# Altium schematic sheet 5_SDRAM.SchDoc: LX9-EVAL Board
size OrCAD A; DocumentNumber: 5; SheetNumber: 6; SheetTotal: 8; PageSetup: Record=PageOptions|CenterHorizontal=True|CenterVertical=True|PrintScale=1.03|XCorrection=1.00|YCorrection=1.00|PrintKind=0|BorderSize=5000000|LeftOffset=0|BottomOffset=0|Orientation=2|PaperLength=1000|PaperWidth=1000|Scale=100|PaperSource=7|PrintQuality=-4|MediaType=1|DitherType=10|PrintScaleMode=1|PaperKind=A4|PaperIndex=9
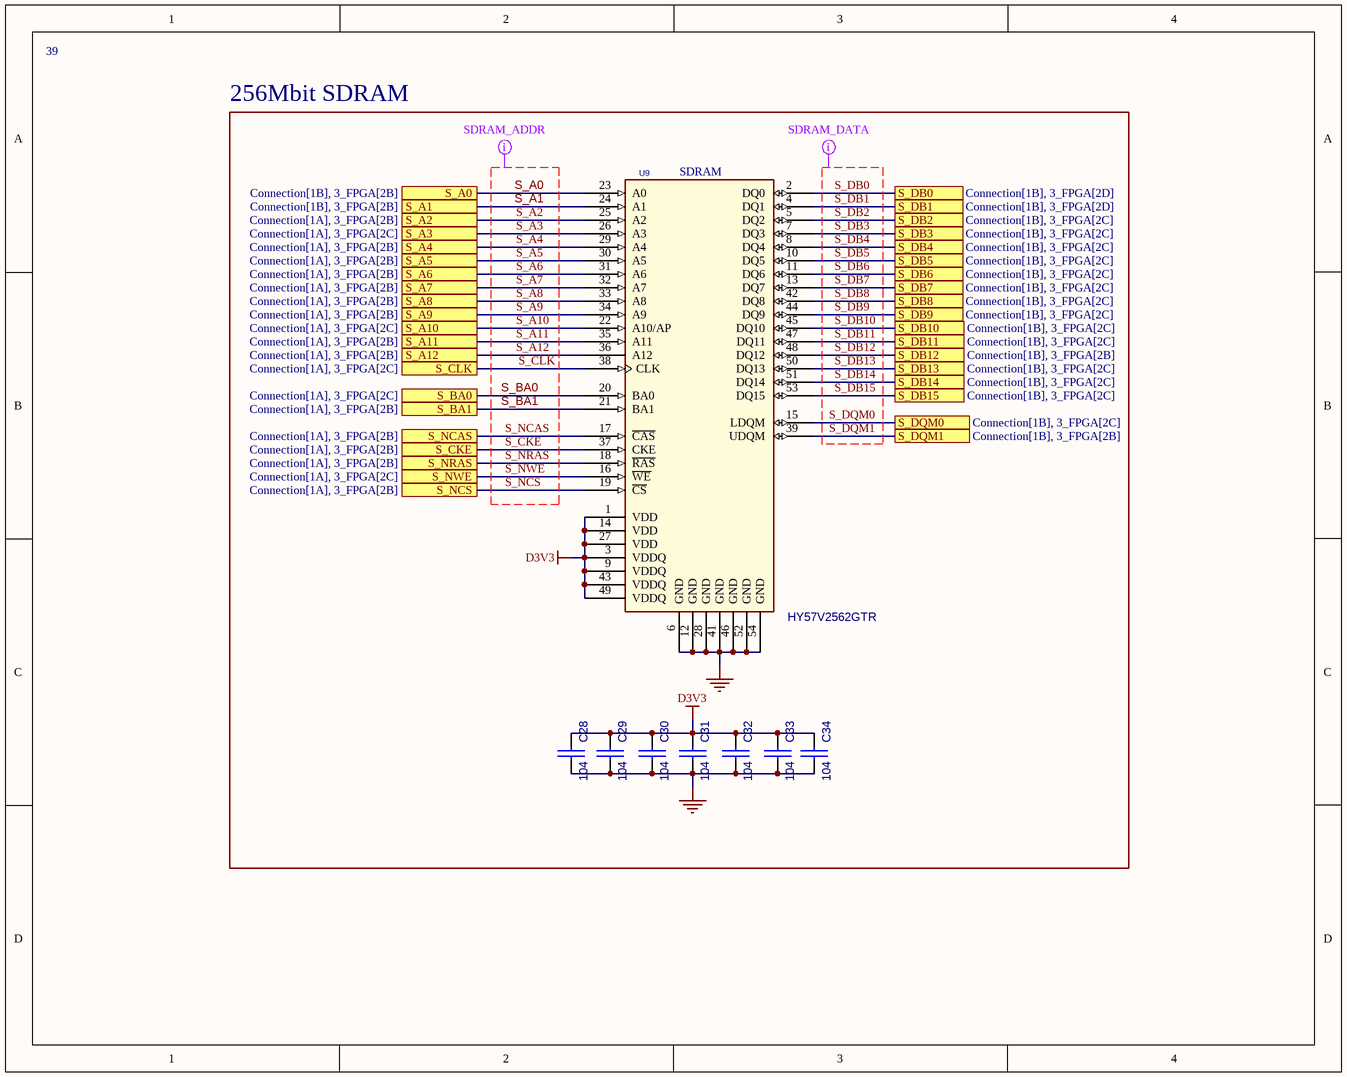
[diagram p0: 5_SDRAM.SchDoc]

## Parts
C28  104  [0402 Cap]
C29  104  [0402 Cap]
C30  104  [0402 Cap]
C31  104  [0402 Cap]
C32  104  [0402 Cap]
C33  104  [0402 Cap]
C34  104  [0402 Cap]
U9  HY57V2562GTR  [TSOP-54]

## Ports
S_A0 (see Connection[1B], 3_FPGA[2B]), S_A1 (see Connection[1B], 3_FPGA[2B]), S_A2 (see Connection[1A], 3_FPGA[2B]), S_A3 (see Connection[1A], 3_FPGA[2C]), S_A4 (see Connection[1A], 3_FPGA[2B]), S_A5 (see Connection[1A], 3_FPGA[2B]), S_A6 (see Connection[1A], 3_FPGA[2B]), S_A7 (see Connection[1A], 3_FPGA[2B]), S_A8 (see Connection[1A], 3_FPGA[2B]), S_A9 (see Connection[1A], 3_FPGA[2B]), S_A10 (see Connection[1A], 3_FPGA[2C]), S_A11 (see Connection[1A], 3_FPGA[2B]), S_A12 (see Connection[1A], 3_FPGA[2B]), S_BA0 (see Connection[1A], 3_FPGA[2C]), S_BA1 (see Connection[1A], 3_FPGA[2B]), S_CKE (see Connection[1A], 3_FPGA[2B]), S_CLK (see Connection[1A], 3_FPGA[2C]), S_DB0 (see Connection[1B], 3_FPGA[2D]), S_DB1 (see Connection[1B], 3_FPGA[2D]), S_DB2 (see Connection[1B], 3_FPGA[2C]), S_DB3 (see Connection[1B], 3_FPGA[2C]), S_DB4 (see Connection[1B], 3_FPGA[2C]), S_DB5 (see Connection[1B], 3_FPGA[2C]), S_DB6 (see Connection[1B], 3_FPGA[2C]), S_DB7 (see Connection[1B], 3_FPGA[2C]), S_DB8 (see Connection[1B], 3_FPGA[2C]), S_DB9 (see Connection[1B], 3_FPGA[2C]), S_DB10 (see Connection[1B], 3_FPGA[2C]), S_DB11 (see Connection[1B], 3_FPGA[2C]), S_DB12 (see Connection[1B], 3_FPGA[2B]), S_DB13 (see Connection[1B], 3_FPGA[2C]), S_DB14 (see Connection[1B], 3_FPGA[2C]), S_DB15 (see Connection[1B], 3_FPGA[2C]), S_DQM0 (see Connection[1B], 3_FPGA[2C]), S_DQM1 (see Connection[1B], 3_FPGA[2B]), S_NCAS (see Connection[1A], 3_FPGA[2B]), S_NCS (see Connection[1A], 3_FPGA[2B]), S_NRAS (see Connection[1A], 3_FPGA[2B]), S_NWE (see Connection[1A], 3_FPGA[2C])

## Nets
D3V3: C28.1 C29.1 C30.1 C31.1 C32.1 C33.1 C34.1 U9.1(VDD) U9.3(VDDQ) U9.9(VDDQ) U9.14(VDD) U9.27(VDD) U9.43(VDDQ) U9.49(VDDQ)
GND: C28.2 C29.2 C30.2 C31.2 C32.2 C33.2 C34.2 U9.6(GND) U9.12(GND) U9.28(GND) U9.41(GND) U9.46(GND) U9.52(GND) U9.54(GND)
S_A0: U9.23(A0) ; port S_A0
S_A1: U9.24(A1) ; port S_A1
S_A2: U9.25(A2) ; port S_A2
S_A3: U9.26(A3) ; port S_A3
S_A4: U9.29(A4) ; port S_A4
S_A5: U9.30(A5) ; port S_A5
S_A6: U9.31(A6) ; port S_A6
S_A7: U9.32(A7) ; port S_A7
S_A8: U9.33(A8) ; port S_A8
S_A9: U9.34(A9) ; port S_A9
S_A10: U9.22(A10/AP) ; port S_A10
S_A11: U9.35(A11) ; port S_A11
S_A12: U9.36(A12) ; port S_A12
S_BA0: U9.20(BA0) ; port S_BA0
S_BA1: U9.21(BA1) ; port S_BA1
S_CKE: U9.37(CKE) ; port S_CKE
S_CLK: U9.38(CLK) ; port S_CLK
S_DB0: U9.2(DQ0) ; port S_DB0
S_DB1: U9.4(DQ1) ; port S_DB1
S_DB2: U9.5(DQ2) ; port S_DB2
S_DB3: U9.7(DQ3) ; port S_DB3
S_DB4: U9.8(DQ4) ; port S_DB4
S_DB5: U9.10(DQ5) ; port S_DB5
S_DB6: U9.11(DQ6) ; port S_DB6
S_DB7: U9.13(DQ7) ; port S_DB7
S_DB8: U9.42(DQ8) ; port S_DB8
S_DB9: U9.44(DQ9) ; port S_DB9
S_DB10: U9.45(DQ10) ; port S_DB10
S_DB11: U9.47(DQ11) ; port S_DB11
S_DB12: U9.48(DQ12) ; port S_DB12
S_DB13: U9.50(DQ13) ; port S_DB13
S_DB14: U9.51(DQ14) ; port S_DB14
S_DB15: U9.53(DQ15) ; port S_DB15
S_DQM0: U9.15(LDQM) ; port S_DQM0
S_DQM1: U9.39(UDQM) ; port S_DQM1
S_NCAS: U9.17(~{CAS}) ; port S_NCAS
S_NCS: U9.19(~{CS}) ; port S_NCS
S_NRAS: U9.18(~{RAS}) ; port S_NRAS
S_NWE: U9.16(~{WE}) ; port S_NWE

## Layout directives
rule Width Constraint [Pref Impedance = 50.00ohms    Min Impedance = 50.00ohms    Max Impedance = 50.00ohms]; rule Matched Net Lengths [Tolerance = 100mil]; net class SDRAM_DATA: S_DB0, S_DB1, S_DB2, S_DB3, S_DB4, S_DB5, S_DB6, S_DB7, S_DB8, S_DB9, S_DB10, S_DB11, S_DB12, S_DB13, S_DB14, S_DB15, S_DQM0, S_DQM1
rule Width Constraint [Pref Impedance = 50.00ohms    Min Impedance = 50.00ohms    Max Impedance = 50.00ohms]; rule Matched Net Lengths [Tolerance = 100mil]; net class SDRAM_ADDR: S_A0, S_A1, S_A2, S_A3, S_A4, S_A5, S_A6, S_A7, S_A8, S_A9, S_A10, S_A11, S_A12, S_BA0, S_BA1, S_CKE, S_CLK, S_NCAS, S_NCS, S_NRAS, S_NWE

## Notes on the sheet
- 39
- 256Mbit SDRAM
- (near U9) SDRAM
- Title
- Size:
- Date:
- Orcad A
- Number:
- Time:
- Revision:
- Sheet
- of
- File:

## Library data of the parts
C28-C34 = C_Dup3
U9 = HY57651620/SO_0